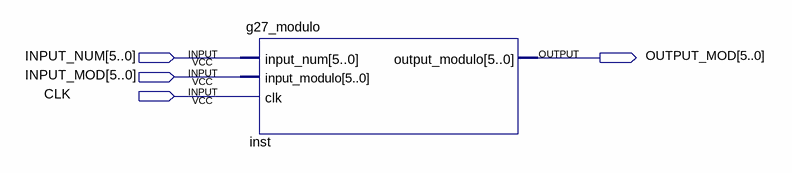
[diagram p0: schematic sheet]
// Quartus schematic g27_modulo_schematic.bdf as structural Verilog: 1 symbols, 4 pins
module g27_modulo_schematic (
  input  [5:0] INPUT_NUM,
  input  [5:0] INPUT_MOD,
  input  CLK,
  output [5:0] OUTPUT_MOD
);

  g27_modulo inst (.input_num(INPUT_NUM), .input_modulo(INPUT_MOD), .clk(CLK), .output_modulo(OUTPUT_MOD));
endmodule
